# Altium schematic sheet TraitementAnalogique.SchDoc: Mini-Projet
size A4; Date: Février 2025; Author: Nolan Ronjon; CompanyName: Coordonnées; Address1: Nolan Ronjon; Address2: 21302313; Address3: L2 DM-IEEA; Address4: nolan.ronjon@etu.sorbonne-universite.fr; DocumentNumber: Schematic.SchDoc; Revision: 1.0; SheetNumber: 1; SheetTotal: 2; ProjectTitle: LU2EE20A; SPICEModelCacheHFZDDCNV: <root> / <DocumentId>HFZDDCNV</DocumentId> / </root>
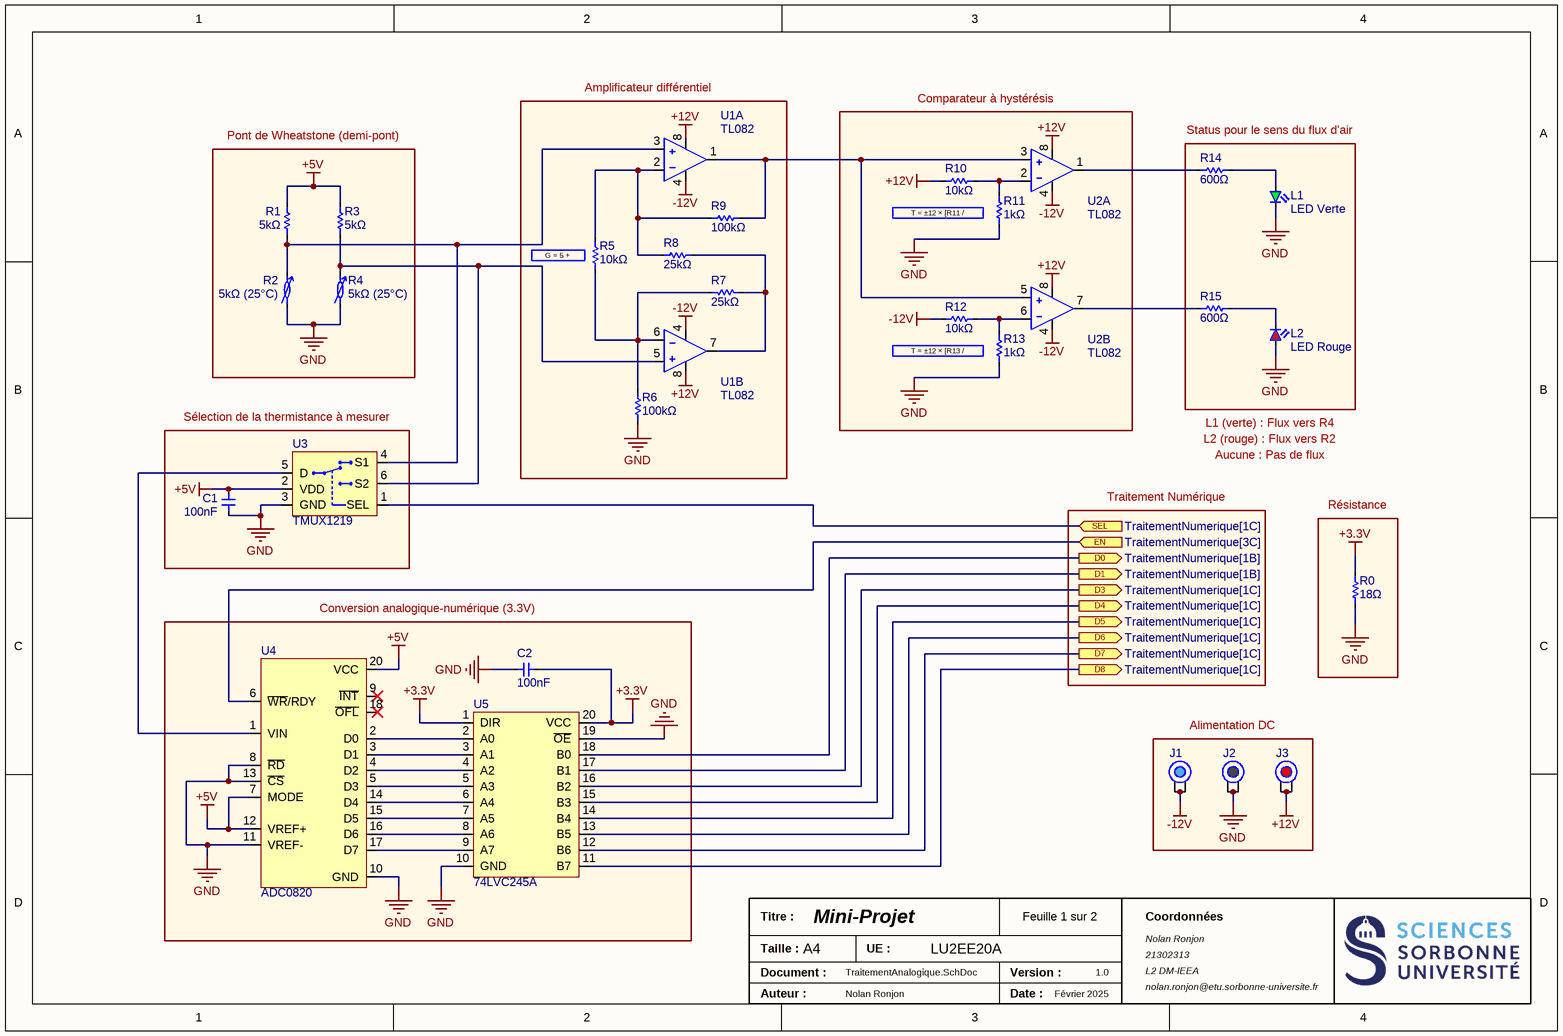
[diagram p0: TraitementAnalogique.SchDoc]

## Parts
C1  value 100nF  [0603]  (hidden comment: Condensateur)
C2  value 100nF  [0603]  (hidden comment: Condensateur)
J1  Fiche Banane  [Fiche Banane]  (value not drawn)
J2  Fiche Banane  [Fiche Banane]  (value not drawn)
J3  Fiche Banane  [Fiche Banane]  (value not drawn)
L1  LED Verte  [0603 (Pol)]
L2  LED Rouge  [0603 (Pol)]
R0  value 18Ω  [Bornier]  (hidden comment: Resistance)
R1  value 5kΩ  [0603]  (hidden comment: Resistance)
R2  value 5kΩ (25°C)  [Bornier]  (hidden comment: CTN)
R3  value 5kΩ  [0603]  (hidden comment: Resistance)
R4  value 5kΩ (25°C)  [Bornier]  (hidden comment: CTN)
R5  value 10kΩ  [0603]  (hidden comment: Resistance)
R6  value 100kΩ  [0603]  (hidden comment: Resistance)
R7  value 25kΩ  [0603]  (hidden comment: Resistance)
R8  value 25kΩ  [0603]  (hidden comment: Resistance)
R9  value 100kΩ  [0603]  (hidden comment: Resistance)
R10  value 10kΩ  [0603]  (hidden comment: Resistance)
R11  value 1kΩ  [0603]  (hidden comment: Resistance)
R12  value 10kΩ  [0603]  (hidden comment: Resistance)
R13  value 1kΩ  [0603]  (hidden comment: Resistance)
R14  value 600Ω  [0603]  (hidden comment: Resistance)
R15  value 600Ω  [0603]  (hidden comment: Resistance)
U1  TL082  [SOIC-8]  (parts A,B of 2)
U2  TL082  [SOIC-8]  (parts A,B of 2)
U3  TMUX1219  [SOT-23-6]
U4  ADC0820  [DIP-20]
U5  74LVC245A  [TSSOP-20]

## Blocks framed on the sheet
Amplificateur différentiel: R5-R9 U1
Comparateur à hystérésis: R10-R13 U2
Pont de Wheatstone (demi-pont): R1-R4
Status pour le sens du flux d'air: L1 L2 R14 R15
Sélection de la thermistance à mesurer: C1 U3
Résistance: R0
Conversion analogique-numérique (3.3V): C2 U4 U5
Alimentation DC: J1-J3

## Ports
D0 (out, see TraitementNumerique[1B]), D1 (out, see TraitementNumerique[1B]), D3 (out, see TraitementNumerique[1C]), D4 (out, see TraitementNumerique[1C]), D5 (out, see TraitementNumerique[1C]), D6 (out, see TraitementNumerique[1C]), D7 (out, see TraitementNumerique[1C]), D8 (out, see TraitementNumerique[1C]), EN (in, see TraitementNumerique[3C]), SEL (in, see TraitementNumerique[1C])

## Nets
+3.3V: C2.2 R0.2 U5.1(DIR) U5.20(VCC)
+5V: C1.1 R1.2 R3.2 U3.2(VDD) U4.7(MODE) U4.12(VREF+) U4.20(VCC)
+12V: J3.1 J3.2 R10.2 U1.8(VCC+) U2.8(VCC+)
-12V: J1.1 J1.2 R12.2 U1.4(VCC-) U2.4(VCC-)
GND: C1.2 C2.1 J2.1 J2.2 L1.2(Cathode) L2.1(Anode) R0.1 R2.1 R4.1 R6.1 R11.1 R13.1 U3.3(GND) U4.8(~{RD}) U4.10(GND) U4.11(VREF-) U4.13(~{CS}) U5.10(GND) U5.19(~{OE})
D0: U5.18(B0) ; port D0
D1: U5.17(B1) ; port D1
D3: U5.16(B2) ; port D3
D4: U5.15(B3) ; port D4
D5: U5.14(B4) ; port D5
D6: U5.13(B5) ; port D6
D7: U5.12(B6) ; port D7
D8: U5.11(B7) ; port D8
EN: U4.6(~{WR}/RDY) ; port EN
SEL: U3.1(SEL) ; port SEL
NetL1_1: L1.1(Anode) R14.1
NetL2_2: L2.2(Cathode) R15.1
NetR1_1: R1.1 R2.2 U1.3(IN+) U3.4(S1)
NetR3_1: R3.1 R4.2 U1.5(IN+) U3.6(S2)
NetR5_1: R5.1 R6.2 R7.2 U1.6(IN-)
NetR5_2: R5.2 R8.2 R9.2 U1.2(IN-)
NetR7_1: R7.1 R8.1 U1.7(OUT)
NetR9_1: R9.1 U1.1(OUT) U2.3(IN+) U2.5(IN+)
NetR10_1: R10.1 R11.2 U2.2(IN-)
NetR12_1: R12.1 R13.2 U2.6(IN-)
NetR14_2: R14.2 U2.1(OUT)
NetR15_2: R15.2 U2.7(OUT)
NetU3_5: U3.5(D) U4.1(VIN)
NetU4_2: U4.2(D0) U5.2(A0)
NetU4_3: U4.3(D1) U5.3(A1)
NetU4_4: U4.4(D2) U5.4(A2)
NetU4_5: U4.5(D3) U5.5(A3)
NetU4_14: U4.14(D4) U5.6(A4)
NetU4_15: U4.15(D5) U5.7(A5)
NetU4_16: U4.16(D6) U5.8(A6)
NetU4_17: U4.17(D7) U5.9(A7)

Not connected (* = marked no-connect by the designer): U4 9(~{INT})* 18(~{OFL})*

## Notes on the sheet
- T = ±12 × [R11 / (R10+R11)]
- (near R5) G = 5 + 200k/R5
- T = ±12 × [R13 / (R12+R13)]
- L1 (verte) : Flux vers R4
- L2 (rouge) : Flux vers R2
- Aucune : Pas de flux
- Traitement Numérique
- Titre :
- Taille :
- Auteur :
- Document :
- A4
- UE :
- Date :
- Version :

## Library data of the parts
J1 = Fiche Banane: Connecteur; Manufacturer Part: 24.243.5; JLCPCB Part: C7437325
J2 = Fiche Banane: Connecteur; Manufacturer Part: 24.243.2; JLCPCB Part: C7437322
J3 = Fiche Banane: Connecteur; Manufacturer Part: 24.243.1; JLCPCB Part: C7437321
L1 = LED Verte: LED; Manufacturer Part: XL-1608UGC-04; JLCPCB Part: C965804
L2 = LED Rouge: LED; Manufacturer Part: XL-1608SURC-06; JLCPCB Part: C965799
R0 = Resistance: Manufacturer Part: WJ500V-5.08-2P; JLCPCB Part: C8465
R2 R4 = CTN: Thermistance; Manufacturer Part: WJ500V-5.08-2P; JLCPCB Part: C8465
U1 U2 = TL082: AOP; Manufacturer Part: TL082IDR; JLCPCB Part: C6966
U3 = TMUX1219: Multiplexeur analogique; Manufacturer Part: TMUX1219DBVR; JLCPCB Part: C2869838
U4 = ADC0820: CAN (8 bit); Manufacturer Part: DS1001-01-20BT1NSF6S-JKB; JLCPCB Part: C72127
U5 = 74LVC245A: Buffer bidirectionnel; Manufacturer Part: SN74LVC245APWR; JLCPCB Part: C7848